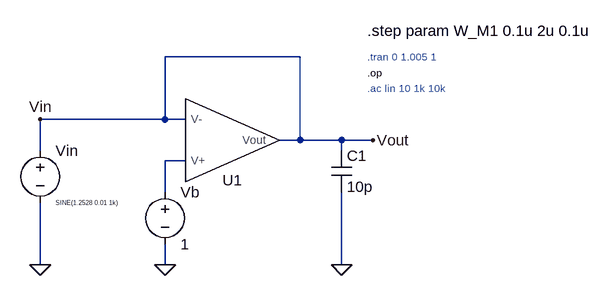
[diagram p0: schematic Slew_Rate.asc]
Slew_Rate.asc, the LTspice schematic file:
Version 4.1
SHEET 1 880 680
WIRE 304 64 96 64
WIRE 96 160 96 64
WIRE 96 160 -96 160
WIRE 128 160 96 160
WIRE 304 192 304 64
WIRE 304 192 272 192
WIRE 368 192 304 192
WIRE 416 192 368 192
WIRE -96 208 -96 160
WIRE 368 208 368 192
WIRE 128 224 96 224
WIRE 96 272 96 224
WIRE -96 384 -96 288
WIRE 96 384 96 352
WIRE 368 384 368 272
FLAG 368 384 0
FLAG 416 192 Vout
FLAG -96 384 0
FLAG 96 384 0
FLAG -96 160 Vin
SYMBOL Wide_Output_OTA_SYM 192 192 M180
WINDOW 0 8 -46 Bottom 2
SYMATTR InstName U1
SYMBOL cap 352 208 R0
SYMATTR InstName C1
SYMATTR Value 10p
SYMBOL voltage -96 192 R0
WINDOW 3 24 96 Left 0
WINDOW 123 0 0 Left 0
WINDOW 39 0 0 Left 0
SYMATTR Value SINE(1.2528 0.01 1k)
SYMATTR InstName Vin
SYMBOL voltage 96 256 R0
WINDOW 123 0 0 Left 0
WINDOW 39 0 0 Left 0
SYMATTR InstName Vb
SYMATTR Value 1
TEXT 408 64 Left 1 ;.tran 0 1.005 1
TEXT 408 88 Left 1 !.op
TEXT 408 112 Left 1 ;.ac lin 10 1k 10k
TEXT 408 24 Left 2 !.step param W_M1 0.1u 2u 0.1u

The netlist it stands for:
* Slew_Rate.asc
X§U1 N001 Vin Vin Wide_Output_OTA_SYM  ; pins V+ V- Vout
C1 Vin 0 10p
Vin Vin 0 SINE(1.2528 0.01 1k)
Vb N001 0 1
* .tran 0 1.005 1
.op
* .ac lin 10 1k 10k
.step param W_M1 0.1u 2u 0.1u
.backanno
.end